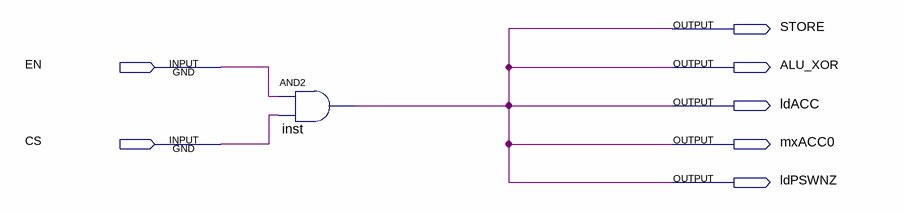
[diagram p0: schematic sheet]
// Quartus schematic XOR_.bdf as structural Verilog: 1 symbols, 7 pins
module XOR_ (
  input  EN,
  input  CS,
  output STORE,
  output ALU_XOR,
  output ldACC,
  output mxACC0,
  output ldPSWNZ
);

  and inst (ALU_XOR, EN, CS);

  assign ldACC = ALU_XOR;
  assign ldPSWNZ = ALU_XOR;
  assign mxACC0 = ALU_XOR;
  assign STORE = ALU_XOR;
endmodule
